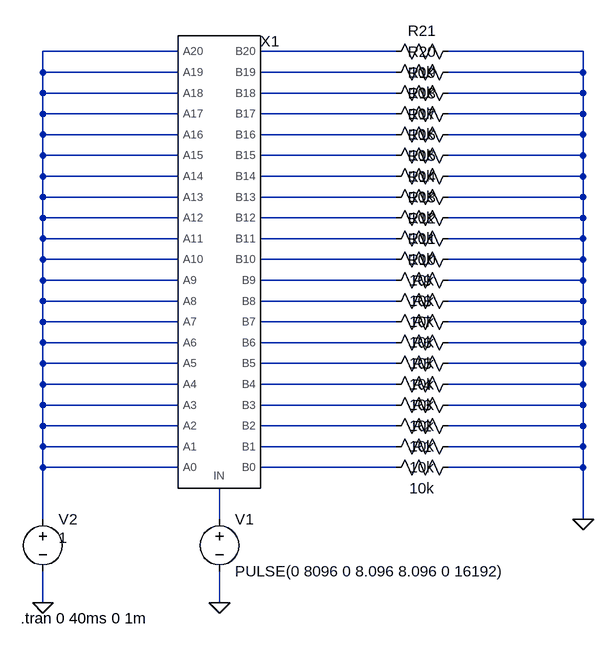
[diagram p0: schematic DivModSwitchTest.asc]
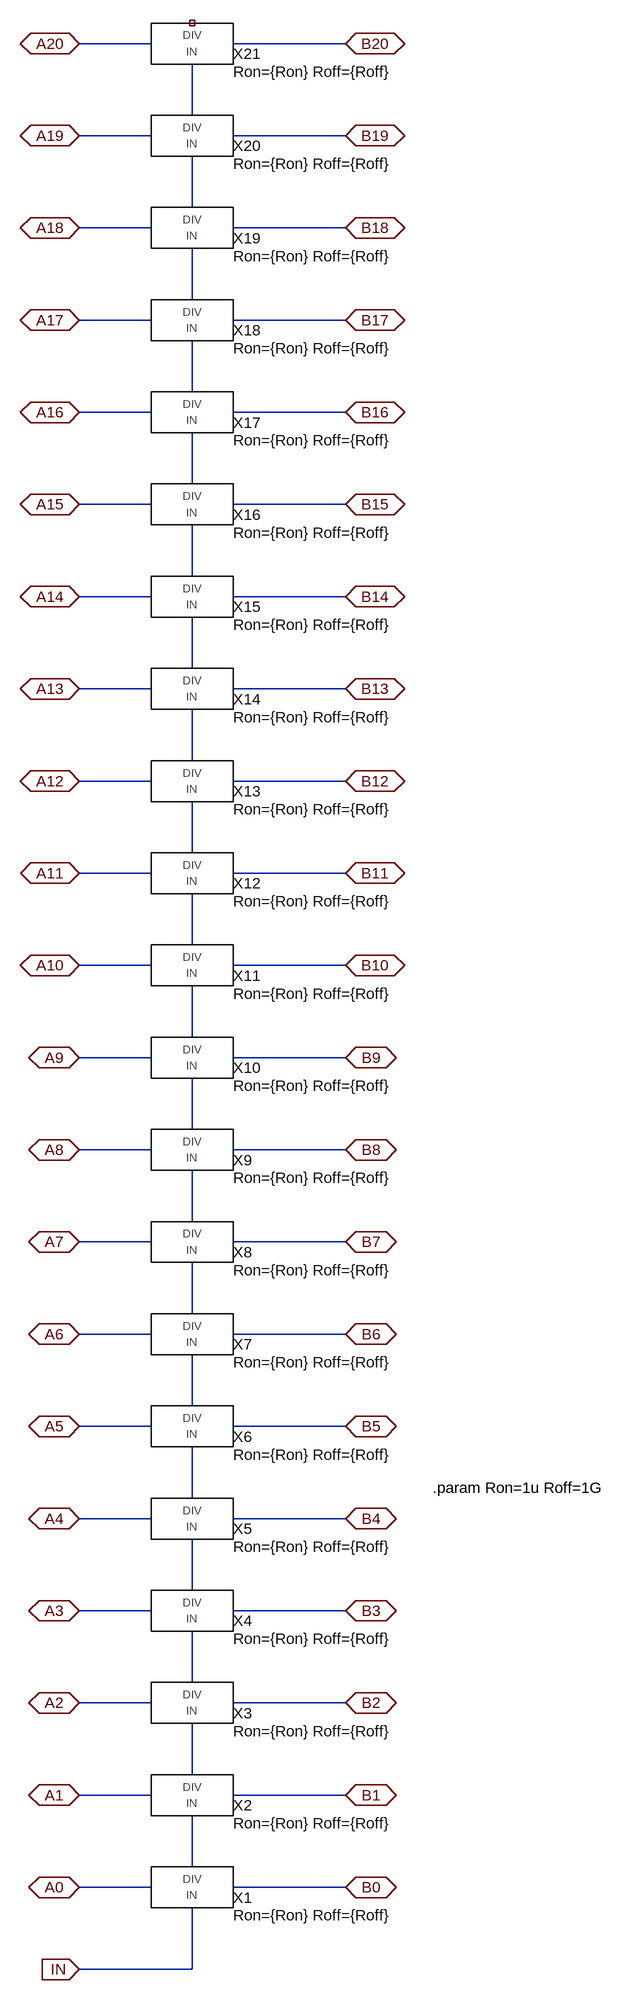
[diagram p1: sub-circuit divmodswitch-21ch.asc]
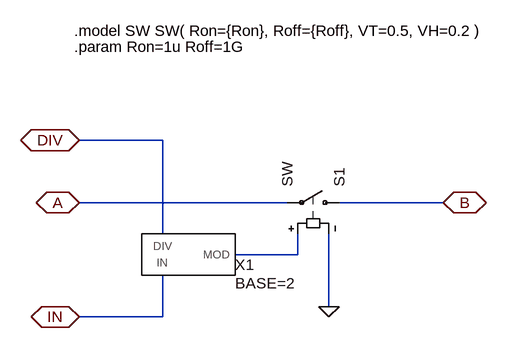
[diagram p2: sub-circuit divmodswitch.asc]
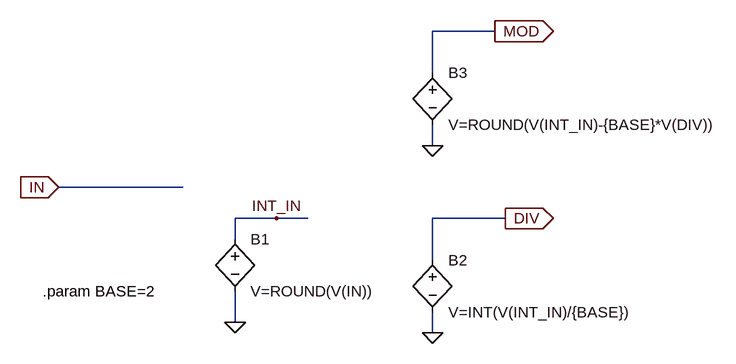
[diagram p3: sub-circuit divmod.asc]
DivModSwitchTest.asc, the LTspice schematic file:
Version 4
SHEET 1 880 728
WIRE 144 -160 -64 -160
WIRE 480 -160 272 -160
WIRE 768 -160 560 -160
WIRE -64 -128 -64 -160
WIRE 144 -128 -64 -128
WIRE 480 -128 272 -128
WIRE 768 -128 768 -160
WIRE 768 -128 560 -128
WIRE -64 -96 -64 -128
WIRE 144 -96 -64 -96
WIRE 480 -96 272 -96
WIRE 768 -96 768 -128
WIRE 768 -96 560 -96
WIRE -64 -64 -64 -96
WIRE 144 -64 -64 -64
WIRE 480 -64 272 -64
WIRE 768 -64 768 -96
WIRE 768 -64 560 -64
WIRE -64 -32 -64 -64
WIRE 144 -32 -64 -32
WIRE 480 -32 272 -32
WIRE 768 -32 768 -64
WIRE 768 -32 560 -32
WIRE -64 0 -64 -32
WIRE 144 0 -64 0
WIRE 480 0 272 0
WIRE 768 0 768 -32
WIRE 768 0 560 0
WIRE -64 32 -64 0
WIRE 144 32 -64 32
WIRE 480 32 272 32
WIRE 768 32 768 0
WIRE 768 32 560 32
WIRE -64 64 -64 32
WIRE 144 64 -64 64
WIRE 480 64 272 64
WIRE 768 64 768 32
WIRE 768 64 560 64
WIRE -64 96 -64 64
WIRE 144 96 -64 96
WIRE 480 96 272 96
WIRE 768 96 768 64
WIRE 768 96 560 96
WIRE -64 128 -64 96
WIRE 144 128 -64 128
WIRE 480 128 272 128
WIRE 768 128 768 96
WIRE 768 128 560 128
WIRE -64 160 -64 128
WIRE 144 160 -64 160
WIRE 480 160 272 160
WIRE 768 160 768 128
WIRE 768 160 560 160
WIRE -64 192 -64 160
WIRE 144 192 -64 192
WIRE 480 192 272 192
WIRE 768 192 768 160
WIRE 768 192 560 192
WIRE -64 224 -64 192
WIRE 144 224 -64 224
WIRE 480 224 272 224
WIRE 768 224 768 192
WIRE 768 224 560 224
WIRE -64 256 -64 224
WIRE 144 256 -64 256
WIRE 480 256 272 256
WIRE 768 256 768 224
WIRE 768 256 560 256
WIRE -64 288 -64 256
WIRE 144 288 -64 288
WIRE 480 288 272 288
WIRE 768 288 768 256
WIRE 768 288 560 288
WIRE -64 320 -64 288
WIRE 144 320 -64 320
WIRE 480 320 272 320
WIRE 768 320 768 288
WIRE 768 320 560 320
WIRE -64 352 -64 320
WIRE 144 352 -64 352
WIRE 480 352 272 352
WIRE 768 352 768 320
WIRE 768 352 560 352
WIRE -64 384 -64 352
WIRE 144 384 -64 384
WIRE 480 384 272 384
WIRE 768 384 768 352
WIRE 768 384 560 384
WIRE -64 416 -64 384
WIRE 144 416 -64 416
WIRE 480 416 272 416
WIRE 768 416 768 384
WIRE 768 416 560 416
WIRE -64 448 -64 416
WIRE 144 448 -64 448
WIRE 480 448 272 448
WIRE 768 448 768 416
WIRE 768 448 560 448
WIRE -64 480 -64 448
WIRE 144 480 -64 480
WIRE 480 480 272 480
WIRE 768 480 768 448
WIRE 768 480 560 480
WIRE -64 560 -64 480
WIRE 208 560 208 512
WIRE 768 560 768 480
WIRE -64 688 -64 640
WIRE 208 688 208 640
FLAG 208 688 0
FLAG -64 688 0
FLAG 768 560 0
SYMBOL DivModSwitch-21ch 208 192 R0
SYMATTR InstName X1
SYMBOL voltage 208 544 R0
WINDOW 123 0 0 Left 0
WINDOW 39 0 0 Left 0
SYMATTR InstName V1
SYMATTR Value PULSE(0 8096 0 8.096 8.096 0 16192)
SYMBOL voltage -64 544 R0
WINDOW 3 24 44 Left 2
WINDOW 123 0 0 Left 0
WINDOW 39 0 0 Left 0
SYMATTR InstName V2
SYMATTR Value 1
SYMBOL res 576 464 R90
WINDOW 0 0 56 VBottom 2
WINDOW 3 32 56 VTop 2
SYMATTR InstName R1
SYMATTR Value 10k
SYMBOL res 576 432 R90
WINDOW 0 0 56 VBottom 2
WINDOW 3 32 56 VTop 2
SYMATTR InstName R2
SYMATTR Value 10k
SYMBOL res 576 400 R90
WINDOW 0 0 56 VBottom 2
WINDOW 3 32 56 VTop 2
SYMATTR InstName R3
SYMATTR Value 10k
SYMBOL res 576 368 R90
WINDOW 0 0 56 VBottom 2
WINDOW 3 32 56 VTop 2
SYMATTR InstName R4
SYMATTR Value 10k
SYMBOL res 576 336 R90
WINDOW 0 0 56 VBottom 2
WINDOW 3 32 56 VTop 2
SYMATTR InstName R5
SYMATTR Value 10k
SYMBOL res 576 304 R90
WINDOW 0 0 56 VBottom 2
WINDOW 3 32 56 VTop 2
SYMATTR InstName R6
SYMATTR Value 10k
SYMBOL res 576 272 R90
WINDOW 0 0 56 VBottom 2
WINDOW 3 32 56 VTop 2
SYMATTR InstName R7
SYMATTR Value 10k
SYMBOL res 576 240 R90
WINDOW 0 0 56 VBottom 2
WINDOW 3 32 56 VTop 2
SYMATTR InstName R8
SYMATTR Value 10k
SYMBOL res 576 208 R90
WINDOW 0 0 56 VBottom 2
WINDOW 3 32 56 VTop 2
SYMATTR InstName R9
SYMATTR Value 10k
SYMBOL res 576 176 R90
WINDOW 0 0 56 VBottom 2
WINDOW 3 32 56 VTop 2
SYMATTR InstName R10
SYMATTR Value 10k
SYMBOL res 576 144 R90
WINDOW 0 0 56 VBottom 2
WINDOW 3 32 56 VTop 2
SYMATTR InstName R11
SYMATTR Value 10k
SYMBOL res 576 112 R90
WINDOW 0 0 56 VBottom 2
WINDOW 3 32 56 VTop 2
SYMATTR InstName R12
SYMATTR Value 10k
SYMBOL res 576 80 R90
WINDOW 0 0 56 VBottom 2
WINDOW 3 32 56 VTop 2
SYMATTR InstName R13
SYMATTR Value 10k
SYMBOL res 576 48 R90
WINDOW 0 0 56 VBottom 2
WINDOW 3 32 56 VTop 2
SYMATTR InstName R14
SYMATTR Value 10k
SYMBOL res 576 16 R90
WINDOW 0 0 56 VBottom 2
WINDOW 3 32 56 VTop 2
SYMATTR InstName R15
SYMATTR Value 10k
SYMBOL res 576 -16 R90
WINDOW 0 0 56 VBottom 2
WINDOW 3 32 56 VTop 2
SYMATTR InstName R16
SYMATTR Value 10k
SYMBOL res 576 -48 R90
WINDOW 0 0 56 VBottom 2
WINDOW 3 32 56 VTop 2
SYMATTR InstName R17
SYMATTR Value 10k
SYMBOL res 576 -80 R90
WINDOW 0 0 56 VBottom 2
WINDOW 3 32 56 VTop 2
SYMATTR InstName R18
SYMATTR Value 10k
SYMBOL res 576 -112 R90
WINDOW 0 0 56 VBottom 2
WINDOW 3 32 56 VTop 2
SYMATTR InstName R19
SYMATTR Value 10k
SYMBOL res 576 -144 R90
WINDOW 0 0 56 VBottom 2
WINDOW 3 32 56 VTop 2
SYMATTR InstName R20
SYMATTR Value 10k
SYMBOL res 576 -176 R90
WINDOW 0 0 56 VBottom 2
WINDOW 3 32 56 VTop 2
SYMATTR InstName R21
SYMATTR Value 10k
TEXT -98 712 Left 2 !.tran 0 40ms 0 1m

divmodswitch-21ch.asc, the sub-circuit schematic file:
Version 4
SHEET 1 988 680
WIRE -656 -2496 -768 -2496
WIRE -352 -2496 -528 -2496
WIRE -592 -2384 -592 -2464
WIRE -656 -2352 -768 -2352
WIRE -352 -2352 -528 -2352
WIRE -592 -2240 -592 -2320
WIRE -656 -2208 -768 -2208
WIRE -352 -2208 -528 -2208
WIRE -592 -2096 -592 -2176
WIRE -656 -2064 -768 -2064
WIRE -352 -2064 -528 -2064
WIRE -592 -1952 -592 -2032
WIRE -656 -1920 -768 -1920
WIRE -352 -1920 -528 -1920
WIRE -592 -1808 -592 -1888
WIRE -656 -1776 -768 -1776
WIRE -352 -1776 -528 -1776
WIRE -592 -1664 -592 -1744
WIRE -656 -1632 -768 -1632
WIRE -352 -1632 -528 -1632
WIRE -592 -1520 -592 -1600
WIRE -656 -1488 -768 -1488
WIRE -352 -1488 -528 -1488
WIRE -592 -1376 -592 -1456
WIRE -656 -1344 -768 -1344
WIRE -352 -1344 -528 -1344
WIRE -592 -1232 -592 -1312
WIRE -656 -1200 -768 -1200
WIRE -352 -1200 -528 -1200
WIRE -592 -1088 -592 -1168
WIRE -656 -1056 -768 -1056
WIRE -352 -1056 -528 -1056
WIRE -592 -944 -592 -1024
WIRE -656 -912 -768 -912
WIRE -352 -912 -528 -912
WIRE -592 -800 -592 -880
WIRE -656 -768 -768 -768
WIRE -352 -768 -528 -768
WIRE -592 -656 -592 -736
WIRE -656 -624 -768 -624
WIRE -352 -624 -528 -624
WIRE -592 -512 -592 -592
WIRE -656 -480 -768 -480
WIRE -352 -480 -528 -480
WIRE -592 -368 -592 -448
WIRE -656 -336 -768 -336
WIRE -352 -336 -528 -336
WIRE -592 -224 -592 -304
WIRE -656 -192 -768 -192
WIRE -352 -192 -528 -192
WIRE -592 -80 -592 -160
WIRE -656 -48 -768 -48
WIRE -352 -48 -528 -48
WIRE -592 64 -592 -16
WIRE -656 96 -768 96
WIRE -352 96 -528 96
WIRE -592 208 -592 128
WIRE -656 240 -768 240
WIRE -352 240 -528 240
WIRE -592 352 -592 272
WIRE -656 384 -768 384
WIRE -352 384 -528 384
WIRE -592 512 -592 416
WIRE -592 512 -768 512
FLAG -768 384 A0
IOPIN -768 384 BiDir
FLAG -768 512 IN
IOPIN -768 512 In
FLAG -352 384 B0
IOPIN -352 384 BiDir
FLAG -768 240 A1
IOPIN -768 240 BiDir
FLAG -352 240 B1
IOPIN -352 240 BiDir
FLAG -768 96 A2
IOPIN -768 96 BiDir
FLAG -352 96 B2
IOPIN -352 96 BiDir
FLAG -768 -48 A3
IOPIN -768 -48 BiDir
FLAG -352 -48 B3
IOPIN -352 -48 BiDir
FLAG -768 -192 A4
IOPIN -768 -192 BiDir
FLAG -352 -192 B4
IOPIN -352 -192 BiDir
FLAG -768 -336 A5
IOPIN -768 -336 BiDir
FLAG -352 -336 B5
IOPIN -352 -336 BiDir
FLAG -768 -480 A6
IOPIN -768 -480 BiDir
FLAG -352 -480 B6
IOPIN -352 -480 BiDir
FLAG -768 -624 A7
IOPIN -768 -624 BiDir
FLAG -352 -624 B7
IOPIN -352 -624 BiDir
FLAG -768 -768 A8
IOPIN -768 -768 BiDir
FLAG -352 -768 B8
IOPIN -352 -768 BiDir
FLAG -768 -912 A9
IOPIN -768 -912 BiDir
FLAG -352 -912 B9
IOPIN -352 -912 BiDir
FLAG -768 -1056 A10
IOPIN -768 -1056 BiDir
FLAG -352 -1056 B10
IOPIN -352 -1056 BiDir
FLAG -768 -1200 A11
IOPIN -768 -1200 BiDir
FLAG -352 -1200 B11
IOPIN -352 -1200 BiDir
FLAG -768 -1344 A12
IOPIN -768 -1344 BiDir
FLAG -352 -1344 B12
IOPIN -352 -1344 BiDir
FLAG -768 -1488 A13
IOPIN -768 -1488 BiDir
FLAG -352 -1488 B13
IOPIN -352 -1488 BiDir
FLAG -768 -1632 A14
IOPIN -768 -1632 BiDir
FLAG -352 -1632 B14
IOPIN -352 -1632 BiDir
FLAG -768 -1776 A15
IOPIN -768 -1776 BiDir
FLAG -352 -1776 B15
IOPIN -352 -1776 BiDir
FLAG -768 -1920 A16
IOPIN -768 -1920 BiDir
FLAG -352 -1920 B16
IOPIN -352 -1920 BiDir
FLAG -768 -2064 A17
IOPIN -768 -2064 BiDir
FLAG -352 -2064 B17
IOPIN -352 -2064 BiDir
FLAG -768 -2208 A18
IOPIN -768 -2208 BiDir
FLAG -352 -2208 B18
IOPIN -352 -2208 BiDir
FLAG -768 -2352 A19
IOPIN -768 -2352 BiDir
FLAG -352 -2352 B19
IOPIN -352 -2352 BiDir
FLAG -768 -2496 A20
IOPIN -768 -2496 BiDir
FLAG -352 -2496 B20
IOPIN -352 -2496 BiDir
SYMBOL DivModSwitch -544 400 M180
WINDOW 39 16 -28 Left 2
SYMATTR InstName X1
SYMATTR SpiceLine Ron={Ron} Roff={Roff}
SYMBOL DivModSwitch -544 256 M180
WINDOW 39 16 -28 Left 2
SYMATTR InstName X2
SYMATTR SpiceLine Ron={Ron} Roff={Roff}
SYMBOL DivModSwitch -544 112 M180
WINDOW 39 16 -28 Left 2
SYMATTR InstName X3
SYMATTR SpiceLine Ron={Ron} Roff={Roff}
SYMBOL DivModSwitch -544 -32 M180
WINDOW 39 16 -28 Left 2
SYMATTR InstName X4
SYMATTR SpiceLine Ron={Ron} Roff={Roff}
SYMBOL DivModSwitch -544 -176 M180
WINDOW 39 16 -28 Left 2
SYMATTR InstName X5
SYMATTR SpiceLine Ron={Ron} Roff={Roff}
SYMBOL DivModSwitch -544 -320 M180
WINDOW 39 16 -28 Left 2
SYMATTR InstName X6
SYMATTR SpiceLine Ron={Ron} Roff={Roff}
SYMBOL DivModSwitch -544 -464 M180
WINDOW 39 16 -28 Left 2
SYMATTR InstName X7
SYMATTR SpiceLine Ron={Ron} Roff={Roff}
SYMBOL DivModSwitch -544 -608 M180
WINDOW 39 16 -28 Left 2
SYMATTR InstName X8
SYMATTR SpiceLine Ron={Ron} Roff={Roff}
SYMBOL DivModSwitch -544 -752 M180
WINDOW 39 16 -28 Left 2
SYMATTR InstName X9
SYMATTR SpiceLine Ron={Ron} Roff={Roff}
SYMBOL DivModSwitch -544 -896 M180
WINDOW 39 16 -28 Left 2
SYMATTR InstName X10
SYMATTR SpiceLine Ron={Ron} Roff={Roff}
SYMBOL DivModSwitch -544 -1040 M180
WINDOW 39 16 -28 Left 2
SYMATTR InstName X11
SYMATTR SpiceLine Ron={Ron} Roff={Roff}
SYMBOL DivModSwitch -544 -1184 M180
WINDOW 39 16 -28 Left 2
SYMATTR InstName X12
SYMATTR SpiceLine Ron={Ron} Roff={Roff}
SYMBOL DivModSwitch -544 -1328 M180
WINDOW 39 16 -28 Left 2
SYMATTR InstName X13
SYMATTR SpiceLine Ron={Ron} Roff={Roff}
SYMBOL DivModSwitch -544 -1472 M180
WINDOW 39 16 -28 Left 2
SYMATTR InstName X14
SYMATTR SpiceLine Ron={Ron} Roff={Roff}
SYMBOL DivModSwitch -544 -1616 M180
WINDOW 39 16 -28 Left 2
SYMATTR InstName X15
SYMATTR SpiceLine Ron={Ron} Roff={Roff}
SYMBOL DivModSwitch -544 -1760 M180
WINDOW 39 16 -28 Left 2
SYMATTR InstName X16
SYMATTR SpiceLine Ron={Ron} Roff={Roff}
SYMBOL DivModSwitch -544 -1904 M180
WINDOW 39 16 -28 Left 2
SYMATTR InstName X17
SYMATTR SpiceLine Ron={Ron} Roff={Roff}
SYMBOL DivModSwitch -544 -2048 M180
WINDOW 39 16 -28 Left 2
SYMATTR InstName X18
SYMATTR SpiceLine Ron={Ron} Roff={Roff}
SYMBOL DivModSwitch -544 -2192 M180
WINDOW 39 16 -28 Left 2
SYMATTR InstName X19
SYMATTR SpiceLine Ron={Ron} Roff={Roff}
SYMBOL DivModSwitch -544 -2336 M180
WINDOW 39 16 -28 Left 2
SYMATTR InstName X20
SYMATTR SpiceLine Ron={Ron} Roff={Roff}
SYMBOL DivModSwitch -544 -2480 M180
WINDOW 39 16 -28 Left 2
SYMATTR InstName X21
SYMATTR SpiceLine Ron={Ron} Roff={Roff}
TEXT -216 -240 Left 2 !.param Ron=1u Roff=1G

divmodswitch.asc, the sub-circuit schematic file:
Version 4
SHEET 1 988 680
WIRE -80 -96 -208 -96
WIRE 112 0 -208 0
WIRE 352 0 192 0
WIRE -80 48 -80 -96
WIRE 128 80 128 48
WIRE 128 80 32 80
WIRE 176 160 176 48
WIRE -80 176 -80 112
WIRE -80 176 -208 176
FLAG 176 160 0
FLAG -208 0 A
IOPIN -208 0 BiDir
FLAG 352 0 B
IOPIN 352 0 BiDir
FLAG -208 176 IN
IOPIN -208 176 BiDir
FLAG -208 -96 DIV
IOPIN -208 -96 BiDir
SYMBOL DivMod -32 80 M180
WINDOW 39 64 -44 Left 2
SYMATTR SpiceLine BASE=2
SYMATTR InstName X1
SYMBOL sw 208 0 M270
SYMATTR InstName S1
TEXT -216 -264 Left 2 !.model SW SW( Ron={Ron}, Roff={Roff}, VT=0.5, VH=0.2 )
TEXT -216 -240 Left 2 !.param Ron=1u Roff=1G

divmod.asc, the sub-circuit schematic file:
Version 4
SHEET 1 2360 1444
WIRE 944 -80 848 -80
WIRE 848 -16 848 -80
WIRE 848 96 848 64
WIRE 464 160 272 160
WIRE 608 208 544 208
WIRE 656 208 608 208
WIRE 960 208 848 208
WIRE 544 240 544 208
WIRE 848 272 848 208
WIRE 544 368 544 320
WIRE 848 384 848 352
FLAG 960 208 DIV
IOPIN 960 208 Out
FLAG 272 160 IN
IOPIN 272 160 In
FLAG 944 -80 MOD
IOPIN 944 -80 Out
FLAG 544 368 0
FLAG 608 208 INT_IN
FLAG 848 384 0
FLAG 848 96 0
SYMBOL bv 544 224 R0
SYMATTR InstName B1
SYMATTR Value V=ROUND(V(IN))
SYMBOL bv 848 256 R0
SYMATTR InstName B2
SYMATTR Value V=INT(V(INT_IN)/{BASE})
SYMBOL bv 848 -32 R0
SYMATTR InstName B3
SYMATTR Value V=ROUND(V(INT_IN)-{BASE}*V(DIV))
TEXT 248 320 Left 2 !.param BASE=2

The netlist it stands for:
* DivModSwitchTest.asc
XX1 N023 N001 N001 N001 N001 N001 N001 N001 N001 N001 N001 N001 N001 N001 N001 N001 N001 N001 N001 N001 N001 N001 N022 N021 N012 N011 N010 N009 N008 N007 N006 N005 N004 N003 N020 N002 N019 N018 N017 N016 N015 N014 N013 divmodswitch-21ch
V1 N023 0 PULSE(0 8096 0 8.096 8.096 0 16192)
V2 N001 0 1
R1 0 N022 10k
R2 0 N021 10k
R3 0 N020 10k
R4 0 N019 10k
R5 0 N018 10k
R6 0 N017 10k
R7 0 N016 10k
R8 0 N015 10k
R9 0 N014 10k
R10 0 N013 10k
R11 0 N012 10k
R12 0 N011 10k
R13 0 N010 10k
R14 0 N009 10k
R15 0 N008 10k
R16 0 N007 10k
R17 0 N006 10k
R18 0 N005 10k
R19 0 N004 10k
R20 0 N003 10k
R21 0 N002 10k

* block symbol definitions
.subckt divmodswitch-21ch IN A0 A1 A10 A11 A12 A13 A14 A15 A16 A17 A18 A19 A2 A20 A3 A4 A5 A6 A7 A8 A9 B0 B1 B10 B11 B12 B13 B14 B15 B16 B17 B18 B19 B2 B20 B3 B4 B5 B6 B7 B8 B9
XX1 IN N020 A0 B0 divmodswitch params: Ron={Ron} Roff={Roff}
XX2 N020 N019 A1 B1 divmodswitch params: Ron={Ron} Roff={Roff}
XX3 N019 N018 A2 B2 divmodswitch params: Ron={Ron} Roff={Roff}
XX4 N018 N017 A3 B3 divmodswitch params: Ron={Ron} Roff={Roff}
XX5 N017 N016 A4 B4 divmodswitch params: Ron={Ron} Roff={Roff}
XX6 N016 N015 A5 B5 divmodswitch params: Ron={Ron} Roff={Roff}
XX7 N015 N014 A6 B6 divmodswitch params: Ron={Ron} Roff={Roff}
XX8 N014 N013 A7 B7 divmodswitch params: Ron={Ron} Roff={Roff}
XX9 N013 N012 A8 B8 divmodswitch params: Ron={Ron} Roff={Roff}
XX10 N012 N011 A9 B9 divmodswitch params: Ron={Ron} Roff={Roff}
XX11 N011 N010 A10 B10 divmodswitch params: Ron={Ron} Roff={Roff}
XX12 N010 N009 A11 B11 divmodswitch params: Ron={Ron} Roff={Roff}
XX13 N009 N008 A12 B12 divmodswitch params: Ron={Ron} Roff={Roff}
XX14 N008 N007 A13 B13 divmodswitch params: Ron={Ron} Roff={Roff}
XX15 N007 N006 A14 B14 divmodswitch params: Ron={Ron} Roff={Roff}
XX16 N006 N005 A15 B15 divmodswitch params: Ron={Ron} Roff={Roff}
XX17 N005 N004 A16 B16 divmodswitch params: Ron={Ron} Roff={Roff}
XX18 N004 N003 A17 B17 divmodswitch params: Ron={Ron} Roff={Roff}
XX19 N003 N002 A18 B18 divmodswitch params: Ron={Ron} Roff={Roff}
XX20 N002 N001 A19 B19 divmodswitch params: Ron={Ron} Roff={Roff}
XX21 N001 NC_01 A20 B20 divmodswitch params: Ron={Ron} Roff={Roff}
.param Ron=1u Roff=1G
.ends divmodswitch-21ch

.subckt divmodswitch IN DIV A B
XX1 IN DIV N001 divmod params: BASE=2
S1 B A N001 0 SW
.model SW SW( Ron={Ron}, Roff={Roff}, VT=0.5, VH=0.2 )
.param Ron=1u Roff=1G
.ends divmodswitch

.subckt divmod IN DIV MOD
B1 INT_IN 0 V=ROUND(V(IN))
B2 DIV 0 V=INT(V(INT_IN)/{BASE})
B3 MOD 0 V=ROUND(V(INT_IN)-{BASE}*V(DIV))
.param BASE=2
.ends divmod

.tran 0 40ms 0 1m
.backanno
.end